# EAGLE schematic linda-arduino-sensor (EAGLE 6.6.0)
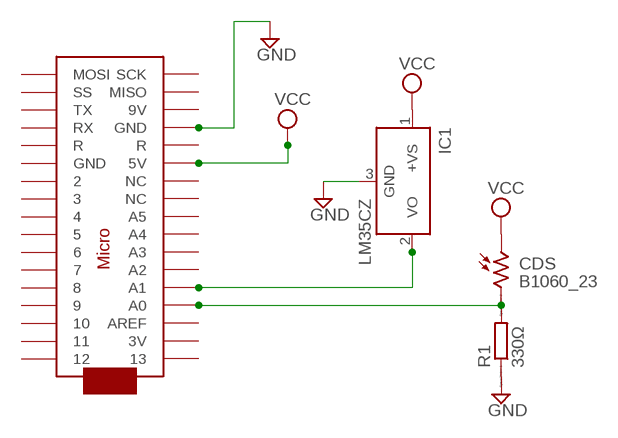
[diagram p0: schematic, sheet 1]

## Parts
CDS  B1060_23  [TO-8_B10]
IC1  LM35CZ  [TO92]
R1  330Ω  R0207/10  [0207/10]
U$1  ARDUINOMICRO  [ARDUINOMICRO]

## Nets
GND: IC1.3(GND) R1.1 U$1.P$12(GND)
N$1: CDS.2 R1.2 U$1.P$31(A0)
N$3: IC1.2(VO) U$1.P$30(A1)
VCC: CDS.1 IC1.1(+VS) U$1.P$23(5V)
Unconnected: U$1.P$1 U$1.P$2 U$1.P$3 U$1.P$4 U$1.P$5 U$1.P$6 U$1.P$7 U$1.P$8 U$1.P$9 U$1.P$10 U$1.P$11 U$1.P$13(R) U$1.P$14(RX) U$1.P$15(TX) U$1.P$16(SS) U$1.P$17(MOSI) U$1.P$18(SCK) U$1.P$19(MISO) U$1.P$20(9V) U$1.P$21(GND) U$1.P$22(R) U$1.P$24(NC) U$1.P$25(NC) U$1.P$26(A5) U$1.P$27(A4) U$1.P$28(A3) U$1.P$29(A2) U$1.P$32(AREF) U$1.P$33(3V) U$1.P$34

## Library data of the parts
CDS = photo-elements:?1060*: Sensor Street Light control Source: http://optoelectronics.perkinelmer.com/content/Datasheets/DTS_PhotocellsB1060.pdf
IC1 = lm35:LM35: Single-Supply Centigrade Temperature Sensor Vout = (10mV/°C x Temp °C) +5mmmV Source: http://www.national.com/ds/LM/LM35.pdf
R1 = eagle-ltspice:R: RESISTOR, European symbol; SPICEMODEL: NONE; SPICEPREFIX: R
U$1 = adafruit:ARDUINOMICRO